# EAGLE design dac-eval-psu (EAGLE 7.3.0)
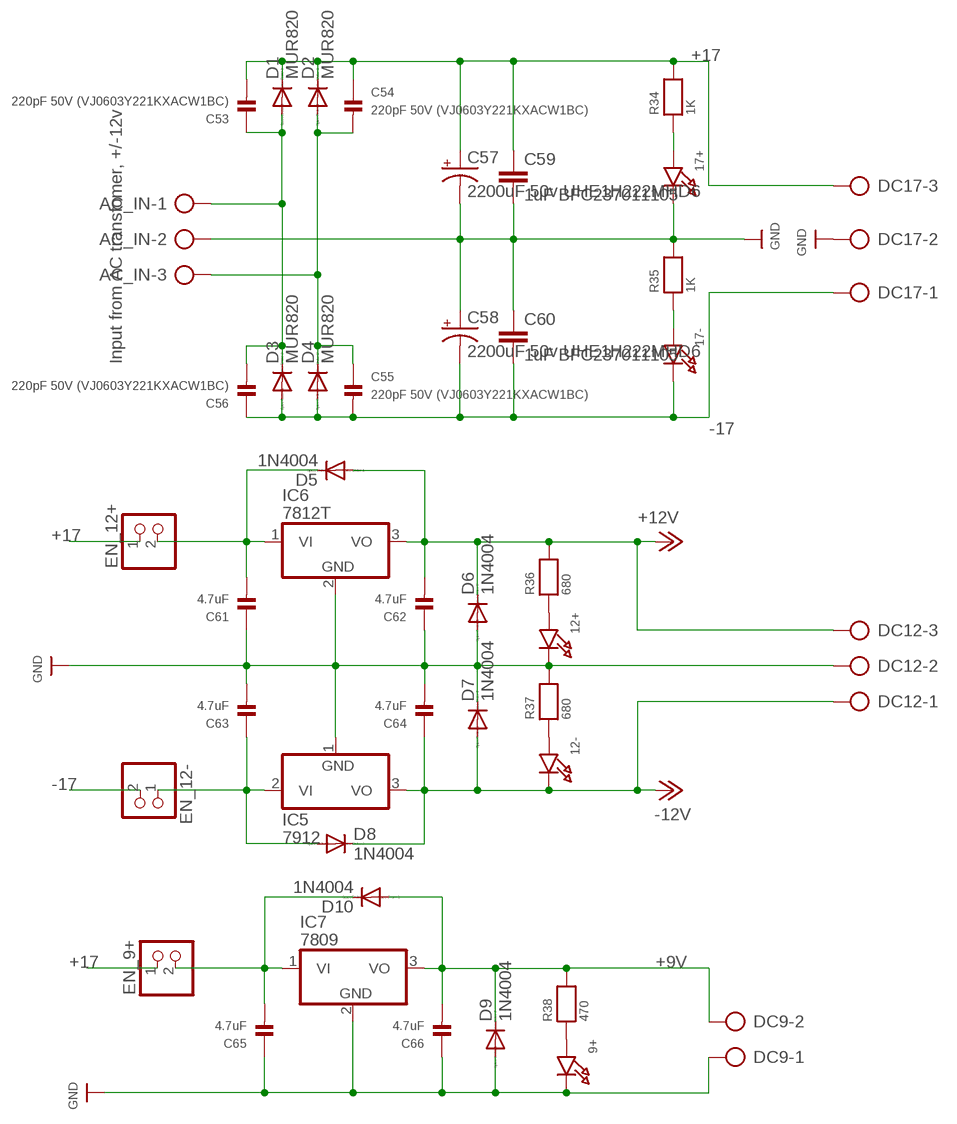
[diagram p0: schematic, sheet 1]

## Parts
9+  LED0603  [CHIPLED_0603]
12+  LED0603  [CHIPLED_0603]
12-  LED0603  [CHIPLED_0603]
17+  LED0603  [CHIPLED_0603]
17-  LED0603  [CHIPLED_0603]
AC_IN  AK500/3  [AK500/3]
C53  220pF 50V (VJ0603Y221KXACW1BC)  CAP_CERAMIC0603  [0603]
C54  220pF 50V (VJ0603Y221KXACW1BC)  CAP_CERAMIC0603  [0603]
C55  220pF 50V (VJ0603Y221KXACW1BC)  CAP_CERAMIC0603  [0603]
C56  220pF 50V (VJ0603Y221KXACW1BC)  CAP_CERAMIC0603  [0603]
C57  2200uF 50v UHE1H222MHD6  CPOL-USE7.5-18  [E7,5-18]
C58  2200uF 50v UHE1H222MHD6  CPOL-USE7.5-18  [E7,5-18]
C59  1uF BFC237011105  C5/7.2  [C5B7.2]
C60  1uF BFC237011105  C5/7.2  [C5B7.2]
C61  4.7uF  CAP_CERAMIC0603  [0603]
C62  4.7uF  CAP_CERAMIC0603  [0603]
C63  4.7uF  CAP_CERAMIC0603  [0603]
C64  4.7uF  CAP_CERAMIC0603  [0603]
C65  4.7uF  CAP_CERAMIC0603  [0603]
C66  4.7uF  CAP_CERAMIC0603  [0603]
D1  MUR820  [C221B1A]
D2  MUR820  [C221B1A]
D3  MUR820  [C221B1A]
D4  MUR820  [C221B1A]
D5  1N4004  [DO41-10]
D6  1N4004  [DO41-10]
D7  1N4004  [DO41-10]
D8  1N4004  [DO41-10]
D9  1N4004  [DO41-10]
D10  1N4004  [DO41-10]
DC9  AK500/2  [AK500/2]
DC12  AK500/3  [AK500/3]
DC17  AK500/3  [AK500/3]
EN_9+  HEADER-1X2ROUND  [1X02_ROUND]
EN_12+  HEADER-1X2ROUND  [1X02_ROUND]
EN_12-  HEADER-1X2ROUND  [1X02_ROUND]
IC5  7912  7912T  [TO220H]
IC6  7812T  [TO220H]
IC7  7809  7812T  [TO220H]
R34  1K  RESISTOR0603  [0603]
R35  1K  RESISTOR0603  [0603]
R36  680  RESISTOR0603  [0603]
R37  680  RESISTOR0603  [0603]
R38  470  RESISTOR0603  [0603]

## Nets
+9V: C66.2 D9.C D10.A DC9.2 IC7.3(VO) R38.2
+12V: C62.2 D5.A D6.C DC12.3 IC6.3(VO) R36.2
+17: C53.2 C54.1 C57.+ C59.1 D1.C D2.C DC17.3 EN_9+.1 EN_12+.1 R34.2
-12V: 12-.C C64.1 D7.A D8.C DC12.1 IC5.3(VO)
-17: 17-.C C55.2 C56.1 C58.- C60.2 D3.A D4.A DC17.1 EN_12-.2
GND: 9+.C 12+.C 17+.C AC_IN.2 C57.- C58.+ C59.2 C60.1 C61.1 C62.1 C63.2 C64.2 C65.1 C66.1 D6.A D7.C D9.A DC9.1 DC12.2 DC17.2 IC5.1(GND) IC6.2(GND) IC7.2(GND) R35.2 R37.2
N$1: C65.2 D10.C EN_9+.2 IC7.1(VI)
N$46: AC_IN.1 C53.1 C56.2 D1.A D3.C
N$47: AC_IN.3 C54.2 C55.1 D2.A D4.C
N$49: 17-.A R35.1
N$50: 17+.A R34.1
N$51: C61.2 D5.C EN_12+.2 IC6.1(VI)
N$55: C63.1 D8.A EN_12-.1 IC5.2(VI)
N$57: 9+.A R38.1
N$62: 12+.A R36.1
N$63: 12-.A R37.1

## Notes on the sheet
- Input from AC transfomer, +/-12v

## Library data of the parts
9+ 12+ 12- 17+ 17- = microbuilder:LED: LED 0603 - 0603 Surface Mount Package 2mA: Green LED - Low Power (3.9mcd, 2ma, 1.7Vf) - Digikey: 475-2709-2-ND Orange LED - Low Power (9.8mcd, 2ma, 1.8Vf) - Digikey: 475-1194-2-ND Red LED - Low Power (5mcd, 2ma, 1.8Vf) - Digikey: 475-1195-2-ND Yellow LED - Low Power (7mcd, 2ma, 1.8Vf) - Digikey: 475-1196-2-ND 5mA: Blue LED - Low Power (17mcd, 5ma, 2.9Vf) - Digikey: LNJ937W8CRACT-ND 0805 - 0805 Surface Mount Package 2mA: Red LED (8.8mcd, 2mA, 1.8Vf, Clear) - Low Power [Digikey: 475-2510-1-ND] Green LED (5mcd, 2mA, 1.8Vf, Clear) - Low Power [Digikey: 475-2730-1-ND] Yellow LED (11.3mcd, 2mA, 1.8Vf, Clear) - Low Power [Digikey: 475-2555-1-ND] 20mA: Red LED (104mcd, 20mA, Diffused) - LS R976 [Digikey: 475-1278-6-ND] Red LED (12mcd, 20mA, 2.0Vf, Clear) - APT2012EC [Digikey: 754-1128-1-ND] Green LED (15mcd, 20mA, 2.2Vf, Clear) - APT2012GC [Digikey: 754-1131-1-ND] Orange LED (160mcd, 20mA, 2.1Vf, Clear) - APT2012SECK [Digikey: 754-1130-1-ND] 1206 - 1206 Surface Mount Package Green LED (26mcd, 20mA, Diffused) - LG N971 [Digikey: 475-1407-6-ND] Red LED (15mcd, 20mA, Diffused) - LH N974 [Digikey: 475-1416-6-ND]
AC_IN DC12 DC17 = con-ptr500:AK500/3: CONNECTOR; OC_FARNELL: unknown; OC_NEWARK: unknown
C53-C56 C61-C66 = microbuilder:CAP_CERAMIC: Ceramic Capacitors 0402 - 0402 Surface Mount Capacitors 16pF 50V 5% [Digikey: 445-4899-2-ND] 18pF 50V 5% [Digikey: 490-1281-2-ND] 22pF 50V 5% [Digikey: 490-1283-2-ND] 68pF 50V 5% [Digikey: 490-1289-2-ND] 0.1uF 10V 10% [Digikey: 490-1318-2-ND] 1.0uF 6.3V 10% [Digikey: 490-1320-2-ND] 0603 - 0603 Surface Mount Capacitors 16 pF 50V 5% [Digikey: 445-5051-2-ND] 22 pF 50V [Digikey: PCC220ACVTR-ND] 33 pF 50V 5% [Digikey: 490-1415-1-ND] 56pF 50V 5% [Digikey: 490-1421-1-ND] 220pF 50V 5% [Digikey: 445-1285-1-ND] 680 pF 50V 2200 pF 50V 5% C0G [Digikey: 445-1297-1-ND] 5600 pF 100V 5% X7R [Digikey: 478-3711-1-ND] 0.1 µF 25V 10% [Digikey: PCC2277TR-ND] 0.22 µF 16V 10% X7R [Digikey: 445-1318-1-ND] 1.0 µF 25V 10% [Digikey: 445-5146-2-ND] 0603 - RF Specific 3pF 250V +/-0.1pF RF [Digikey: 712-1347-1-ND] 18 pF 250V 5% [Digikey: 478-3505-1-ND or 712-1322-1-ND] 56 pF 250V 5% C0G RF [Digikey: 490-4867-1-ND] 68 pF 250V RF [Digikey: 490-4868-1-ND] 0805 - 0805 Surface Mount Capacitors 220 pF 250V 2% RF Ceramic Capacitor [Digikey: 712-1398-1-ND] 1000 pF 50V 2% NP0 Ceramic Capacitor [Digikey: 478-3760-1-ND] 0.1 µF 25V 10% Ceramic Capacitor [Digikey: PCC1828TR-ND] 1.0 µF 16V 10% Ceramic Capacitor[Digikey: 490-1691-2-ND] 10.0 µF 10V 10% Ceramic Capacitor[Digikey: 709-1228-1-ND] 10.0 uF 16V 10% Ceramic Capacitor [Digikey: 478-5165-2-ND] 47 uF 6.3V 20% Ceramic Capacitor [Digikey: 587-1779-1-ND or 399-5506-1-ND] 1206 - 1206 Surface Mount Capacitors 47uF 10V 20% Ceramic Capacitor [Digikey: 490-5528-1-ND or 399-5508-1-ND or 445-6010-1-ND] 100uF 6.3V -20%, +80% Y5V Ceramic Capacitor (Digikey: 490-4512-1-ND, Mouser: 81-GRM31CF50J107ZE1L)
C57 C58 = rcl:CPOL-US: POLARIZED CAPACITOR, American symbol
C59 C60 = capacitor-wima:C: CAPACITOR naming: grid - package width
D1-D4 = diode:MUR820: DIODE
D5-D10 = diode:1N4004: DIODE general purpose rectifier, 1 A
DC9 = con-ptr500:AK500/2: CONNECTOR; OC_FARNELL: unknown; OC_NEWARK: unknown
EN_9+ EN_12+ EN_12- = microbuilder:HEADER-1X2: PIN HEADER
IC5 = linear:79*: Negative VOLTAGE REGULATOR
IC6 IC7 = linear:78*: Positive VOLTAGE REGULATOR Source: http://cache.national.com/ds/LM/LM78L05.pdf http://www.fairchildsemi.com/ds/LM/LM7805.pdf
R34-R38 = microbuilder:RESISTOR: Resistors 0402 - 0402 Surface Mount Package 22 Ohm 1% 1/16W [Digikey: 311-22.0LRTR-ND] 33 Ohm 5% 1/16W 1.0K 5% 1/16W 1.5K 5% 1/16W 2.0K 1% 1/16W 10.0K 1% 1/16W [Digikey: 311-10.0KLRTR-ND] 10.0K 5% 1/16W [Digikey: RMCF0402JT10K0TR-ND] 12.1K 1% 1/16W [Digikey: 311-22.0LRTR-ND] 100.0K 5% 1/16W 0603 - 0603 Surface Mount Package 0 Ohm 1/10 Watt 1% Resistor 15 Ohm 1/10 Watt 1% Resistor 33 Ohm 1/10 Watt 1% Resistor 49.9 Ohm 1/10 Watt 1% Resistor 100 Ohm 1/10 Watt 1% Resistor 150 Ohm 1/10 Watt 1% Resistor 240 Ohm 1/10 Watt 1% Resistor 390 Ohm 1/10 Watt 1% Resistor 560 Ohm 1/10 Watt 1% Resistor 680 Ohm 1/10 Watt 1% Resistor 750 Ohm 1/10 Watt 1% Resistor 1.0K Ohm 1/10 Watt 1% Resistor 1.5K Ohm 1/10 Watt 1% Resistor 2.0K Ohm 1/10 Watt 1% Resistor 2.2K Ohm 1/10 Watt 1% Resistor 3.3K Ohm 1/10 Watt 1% Resistor 4.7K Ohm 1/10 Watt 1% Resistor 10.0K Ohm 1/10 Watt 1% Resistor 12.0K Ohm 1/10 Watt 1% Resistor 12.1K Ohm 1/10 Watt 1% Resistor 20.0K Ohm 1/10 Watt 1% Resistor 33.0K Ohm 1/10 Watt 1% Resistor 100.0K Ohm 1/10 Watt 1% Resistor 0805 - 0805 Surface Mount Package 0 Ohm 1/8 Watt 1% Resistor 33 Ohm 1/8 Watt 1% Resistor 100 Ohm 1/8 Watt 1% Resistor 150 Ohm 1/8 Watt 1% Resistor 200 Ohm 1/8 Watt 1% Resistor 240 Ohm 1/8 Watt 1% Resistor 330 Ohm 1/8 Watt 1% Resistor 390 Ohm 1/8 Watt 1% Resistor 470 Ohm 1/8 Watt 1% Resistor 1.0K Ohm 1/8 Watt 1% Resistor 1.5K Ohm 1/8 Watt 1% Resistor 2.0K Ohm 1/8 Watt 1% Resistor 4.7K Ohm 1/8 Watt 1% Resistor 5.1K Ohm 1/8 Watt 1% Resistor 5.6K Ohm 1/8 Watt 1% Resistor 10.0K Ohm 1/8 Watt 1% Resistor 22.0K Ohm 1/8 Watt 1% Resistor 33.0K Ohm 1/8 Watt 1% Resistor 100K Ohm 1/8 Watt 1% Resistor 1206 - 1206 Surface Mount Package 2012 - 2010 Surface Mount Package 0.11 Ohm 1/2 Watt 1% Resistor - Digikey: RHM.11UCT-ND

## Board
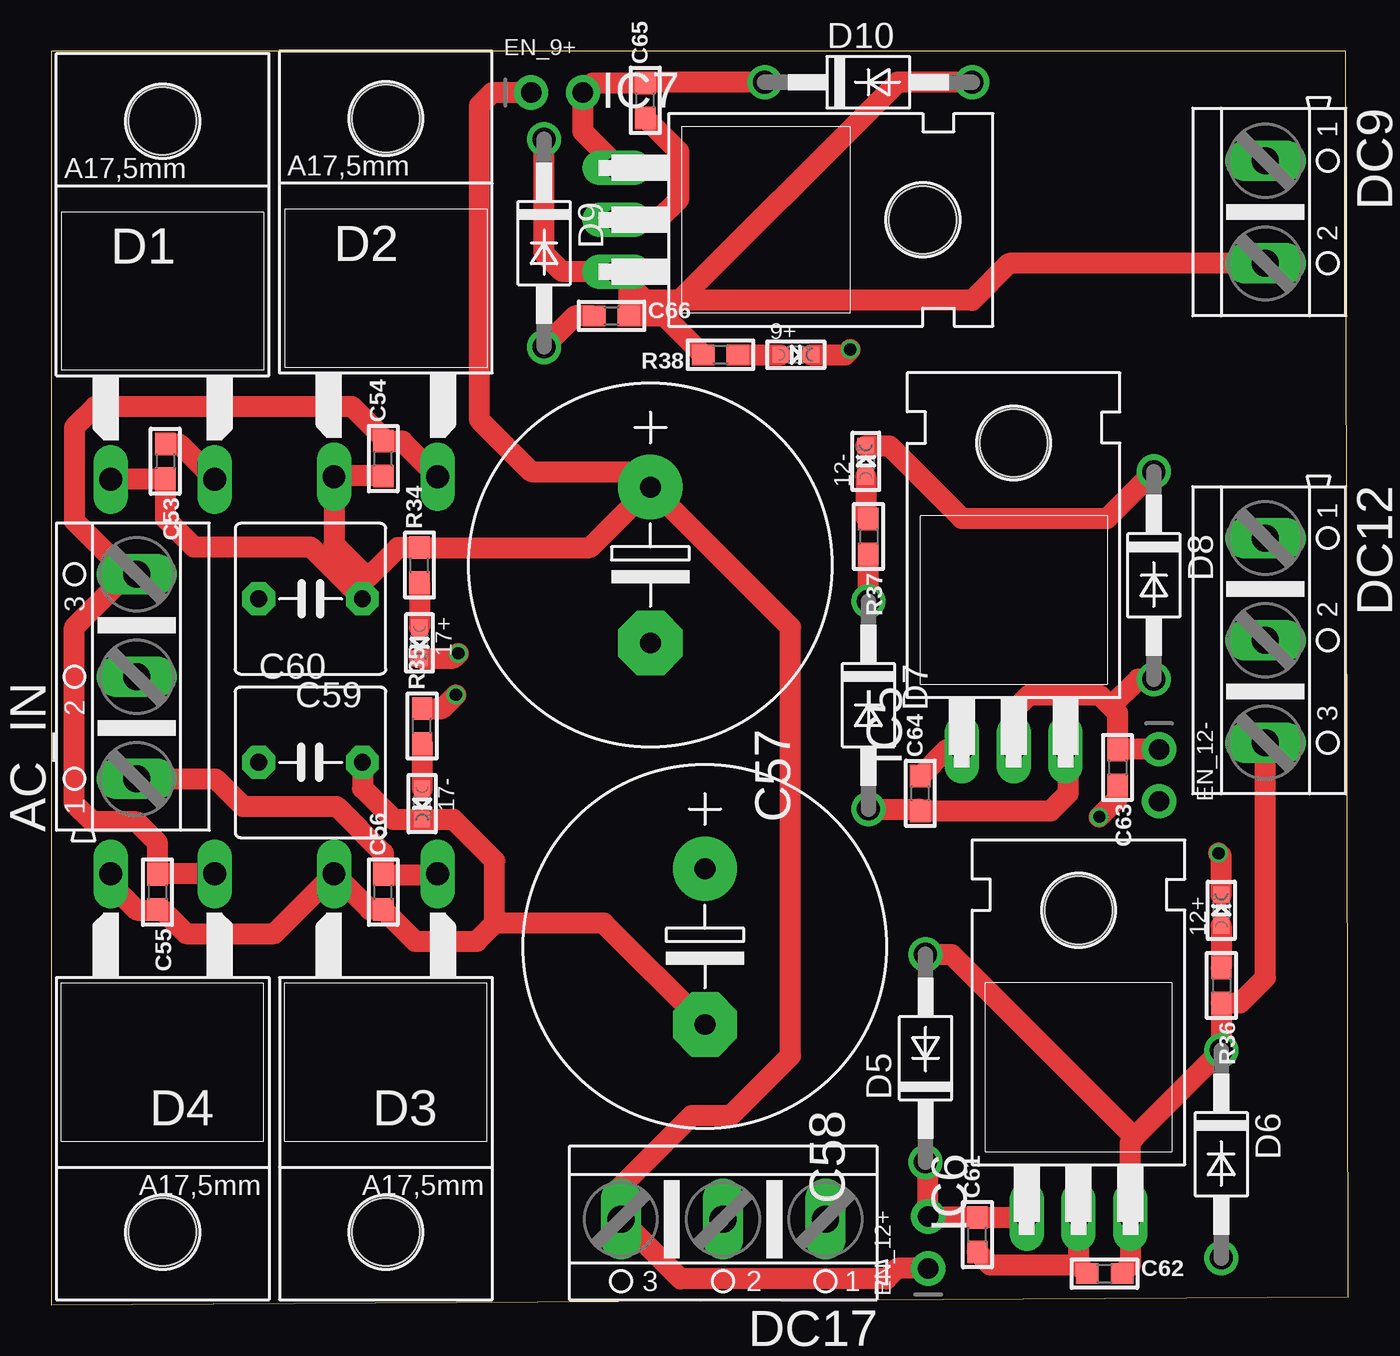
[diagram p1: board, top side]
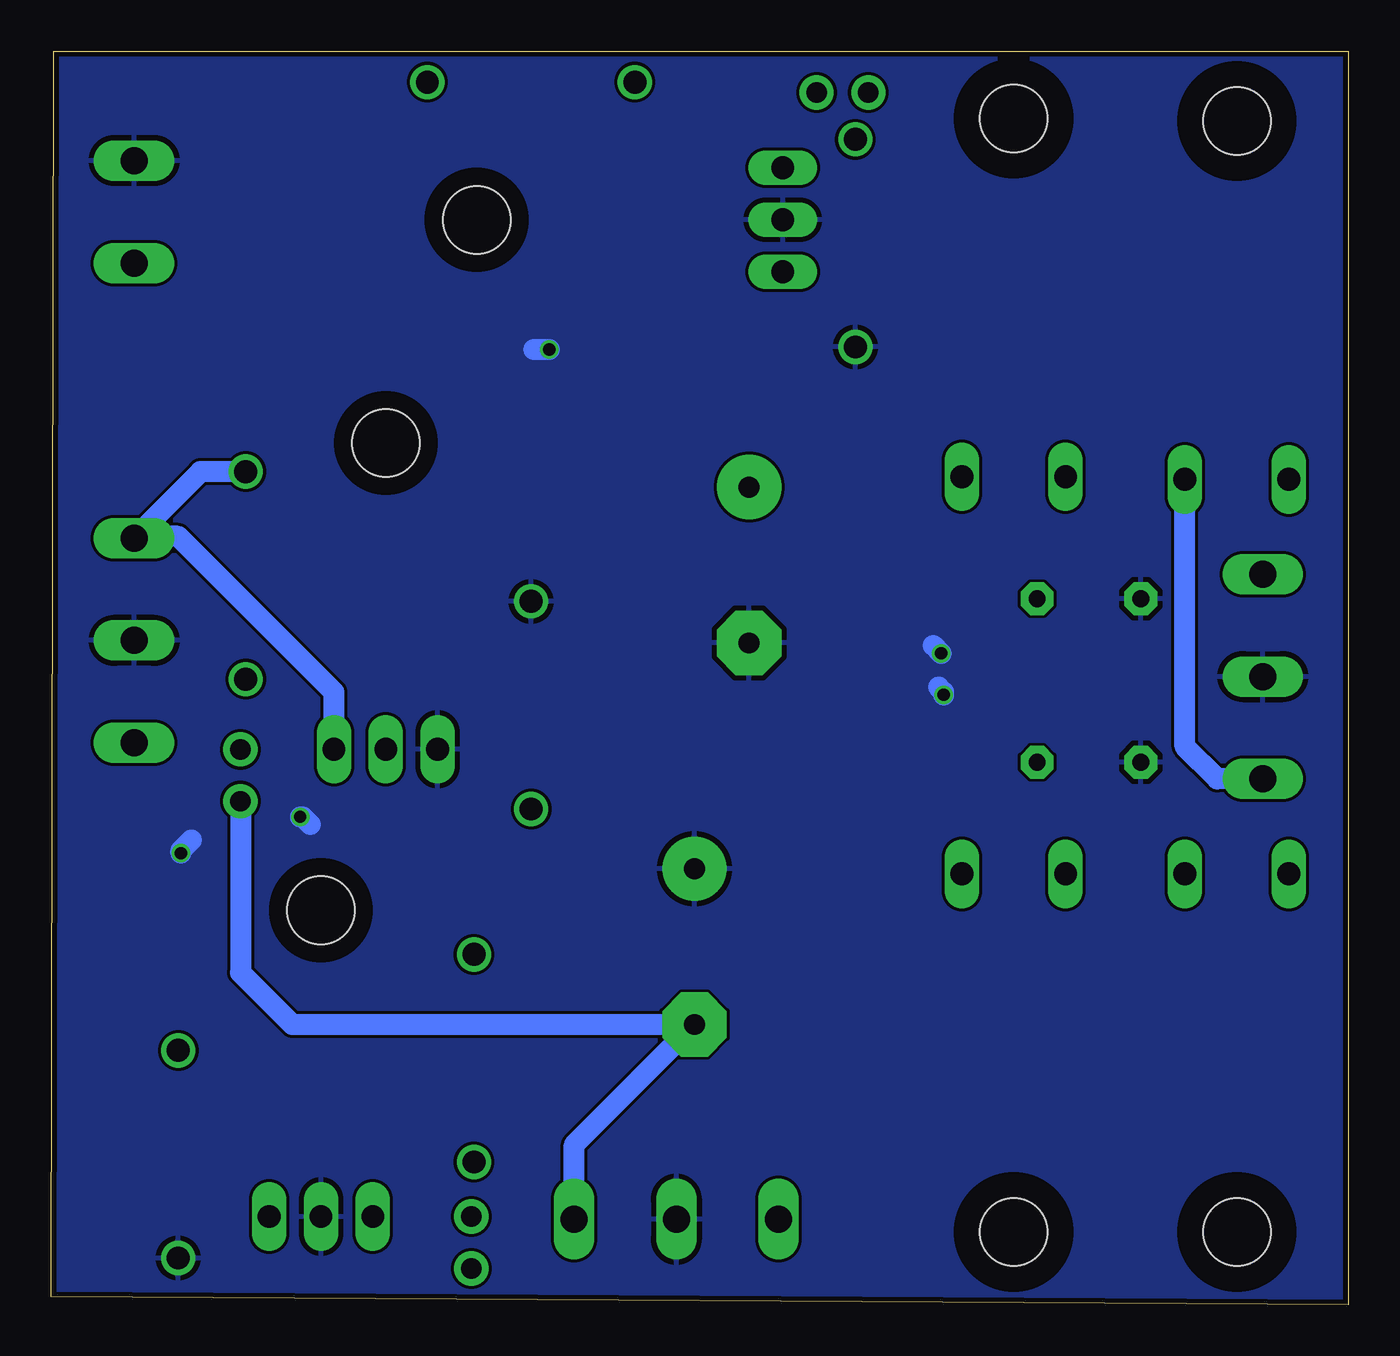
[diagram p2: board, bottom side, seen from below]

Size 63.5 x 61.34 mm. Coordinates in mm from the lower left corner, seen from the top.
Outline: 0,0 63.5,0.38 63.37,61.34 0,61.34 0,0
Copper layers (1*16): Top 0.035mm / dielectric 1.5mm / Bottom 0.035mm
Design rules "MacroFab_Standard_2_Layer *": minimum track width 6mil, minimum drill 12mil, track to track 6mil, track to pad 6mil, pad to pad 6mil, via to via 6mil, smd to smd 0mil, copper to edge 10mil, drill to drill 10mil, minimum pad ring 6mil, minimum via ring 6mil, stop-mask expansion 2mil, vias tented up to drill 25mil, thermal gap 10mil

### Footprints (pad centres in the part's own frame; a part is rotated, then mirrored left to right if it is on the bottom)
CHIPLED_0603 = smd 0.8 x 0.8: A 0,-0.75; C 0,0.75
AK500/3 = drill 1.321 long: 1 -5.004,0; 2 0,0; 3 5.004,0
0603 = smd 1.1 x 1: 1 -0.85,0; 2 0.85,0
E7,5-18 = drill 1.016 pad 3.15: + -3.81,0 | drill 1.016 pad 3.15 octagon: - 3.81,0
C5B7.2 = drill 0.813 pad 1.6 octagon: 1 -2.54,0; 2 2.54,0
C221B1A = drill 1.118 long: A 2.54,-6.35; C -2.54,-6.35 | hole 3.302: 0,11.176
DO41-10 = drill 1.118: A 5.08,0; C -5.08,0
AK500/2 = drill 1.321 long: 1 -2.515,0; 2 2.515,0
1X02_ROUND = drill 1 pad 1.676: 1 -1.27,0; 2 1.27,0
TO220H = drill 1.118 long: 1 -2.54,-10.16; 2 0,-10.16; 3 2.54,-10.16 | hole 3.302: 0,4.826

### Placement (x,y rotation side)
9+  36.45,46.48 270 top
12+  57.28,19.3 0 top
12-  39.88,41.27 0 top
17+  18.03,32.38 180 top
17-  18.16,24.51 180 top
AC_IN  4.19,30.73 90 top
C53  5.59,41.27 270 top
C54  16.26,41.4 90 top
C55  5.21,20.19 270 top
C56  16.26,20.19 90 top
C57  29.34,36.2 270 top
C58  32,17.53 270 top
C59  12.7,34.54 180 top
C60  12.7,26.54 0 top
C61  45.34,3.43 90 top
C62  51.56,1.52 0 top
C63  52.2,26.29 270 top
C64  42.55,25.02 90 top
C65  29.08,58.93 90 top
C66  27.43,48.39 0 top
D1  5.46,46.74 0 top
D2  16.38,46.86 0 top
D3  16.38,14.73 180 top
D4  5.46,14.73 180 top
D5  42.8,12.06 90 top
D6  57.28,7.37 270 top
D7  40.01,29.34 270 top
D8  53.98,35.69 270 top
D9  24.13,51.94 270 top
D10  40.01,59.82 0 top
DC9  59.44,53.47 270 top
DC12  59.44,32.51 270 top
DC17  32.89,4.19 180 top
EN_9+  24.77,59.31 0 top
EN_12+  42.93,3.05 90 top
EN_12-  54.23,25.91 270 top
IC5  47.12,37.34 0 top
IC6  50.29,14.48 0 top
IC7  37.85,53.09 270 top
R34  18.03,36.2 90 top
R35  18.16,28.32 90 top
R36  57.28,15.62 270 top
R37  40.01,37.59 270 top
R38  32.77,46.48 180 top

### Tracks (layer width: path | path; a pad name or v marks a point on that pad's centre or on a via)
+9V
  Top 1.016: D9.C 24.13,51.44 25.02,50.55 IC7.3 28.28,49.95 | 28.28,49.95 C66.2 30.01,48.39 | 30.01,48.39 R38.2 | D10.A 41.44,59.82 30.01,48.39 | DC9.2 46.89,50.95 45.09,49.15 29.08,49.15 28.28,49.95
+12V
  Top 1.016: C62.2 52.83,1.94 IC6.3 52.83,8 53.02,8.19 | 53.02,8.19 D6.C R36.2 58.2,14.77 59.44,16 DC12.3 | D5.A 44.07,17.14 53.02,8.19
+17
  Top 1.016: C59.1 15.53,34.54 | C57.+ 26.38,37.05 R34.2 16.98,37.05 14.86,34.92 | D1.C 2.96,40.42 C53.2 5.59,38.48 6.99,37.08 12.7,37.08 14.86,34.92 | 14.86,34.92 C59.1 | C54.1 13.88,40.55 D2.C 13.84,37.21 15.24,35.81 C59.1 | EN_9+.1 21.59,59.31 20.95,58.67 20.95,43.31 23.5,40.77 28.57,40.77 C57.+ | C57.+ 36.2,33.15 36.2,12.19 33.27,9.27 31.37,9.27 27.89,5.79 DC17.3 30.81,1.27 40.89,1.27 41.4,1.78 EN_12+.1
-12V
  Top 1.016: D7.A 42.46,24.26 C64.1 48.93,24.17 49.78,25.02 49.78,27.05 IC5.3 | 12-.C 41.03,42.02 44.58,38.48 51.69,38.48 D8.C
  Bottom 1.016: IC5.3 49.66,29.97 57.28,37.59 59.36,37.59 DC12.1 56.19,40.77 D8.C
-17
  Top 1.016: D4.A 2.92,20.57 4.19,19.3 5.17,19.3 C55.2 5.42,19.34 6.6,18.16 10.92,18.16 D3.A 15.58,19.34 C56.1 17.82,17.78 20.83,17.78 21.72,18.67 | C60.2 15.24,25.27 16.76,23.75 18.15,23.75 17-.C 19.67,23.76 21.72,21.72 21.72,18.67 | C58.- 27.05,18.67 21.72,18.67
  Bottom 1.016: DC17.1 37.9,7.82 C58.- 51.69,13.72 54.23,16.26 EN_12-.2
GND  (via drill 0.6)
  Top 1.016: 17+.C 19.7,31.64 v19.94,31.88 | R35.2 19.14,29.17 v19.81,29.84 | C66.1 25.65,48.39 D9.A | IC7.2 29.72,53.09 30.73,54.1 30.73,56.43 C65.1 | 9+.C 38.86,46.48 v39.12,46.74 | D7.C R37.2 | IC6.2 50.29,1.94 | 50.29,1.94 C62.1 | 12+.C 57.28,21.97 v57.15,22.1 | 50.29,1.94 45.97,1.94 C61.1 | IC5.1 43.85,27.18 C64.2 | C63.2 52.2,24.77 v51.31,23.88
  Bottom 1.016: v19.94,31.88 20.32,32.26 | v19.81,29.84 19.81,29.97 20.07,30.23 | v39.12,46.74 39.88,46.74 | v57.15,22.1 57.15,22.23 56.64,22.73 | v51.31,23.88 51.18,23.88 50.8,23.5
  pour Bottom: 66.17,62.23 66.17,-1.27 -2.79,-1.27 -2.79,62.23
N$1
  Top 1.016: IC7.1 27.69,55.75 26.04,57.4 EN_9+.2 26.5,59.78 C65.2 29.12,59.82 D10.C
N$46
  Top 1.016: C53.1 6.26,42.12 D1.A | AC_IN.1 8.05,25.73 9.4,24.38 13.97,24.38 16.26,22.1 C56.2 18.88,21.04 D3.C
  Bottom 1.016: AC_IN.1 6.43,25.73 8,27.3 D1.A
N$47
  Top 1.016: D2.A 17.18,42.25 C54.2 16.26,42.42 14.73,43.94 2.16,43.94 1.14,42.93 1.14,38.35 3.76,35.74 AC_IN.3 4.14,35.69 3.68,35.69 1.14,33.15 1.14,24.51 2.03,23.62 4.19,23.62 5.21,22.61 C55.1 5.25,21.08 D4.C
N$49
  Top 1.016: R35.1 17-.A
N$50
  Top 1.016: R34.1 17+.A
N$51
  Top 1.016: D5.C 42.93,6.86 EN_12+.2 42.97,4.28 C61.2 47.71,4.28 IC6.1
N$55
  Top 1.016: IC5.2 47.12,29.08 47.88,29.84 51.31,29.84 51.88,29.27 | 51.88,29.27 52.2,28.96 C63.1 52.24,27.18 EN_12-.1 | D8.A 53.21,30.61 51.88,29.27
N$57
  Top 1.016: R38.1 9+.A
N$62
  Top 1.016: 12+.A R36.1
N$63
  Top 1.016: 12-.A 39.88,38.57 R37.1